# EAGLE design led_jetracer (EAGLE 9.6.2)
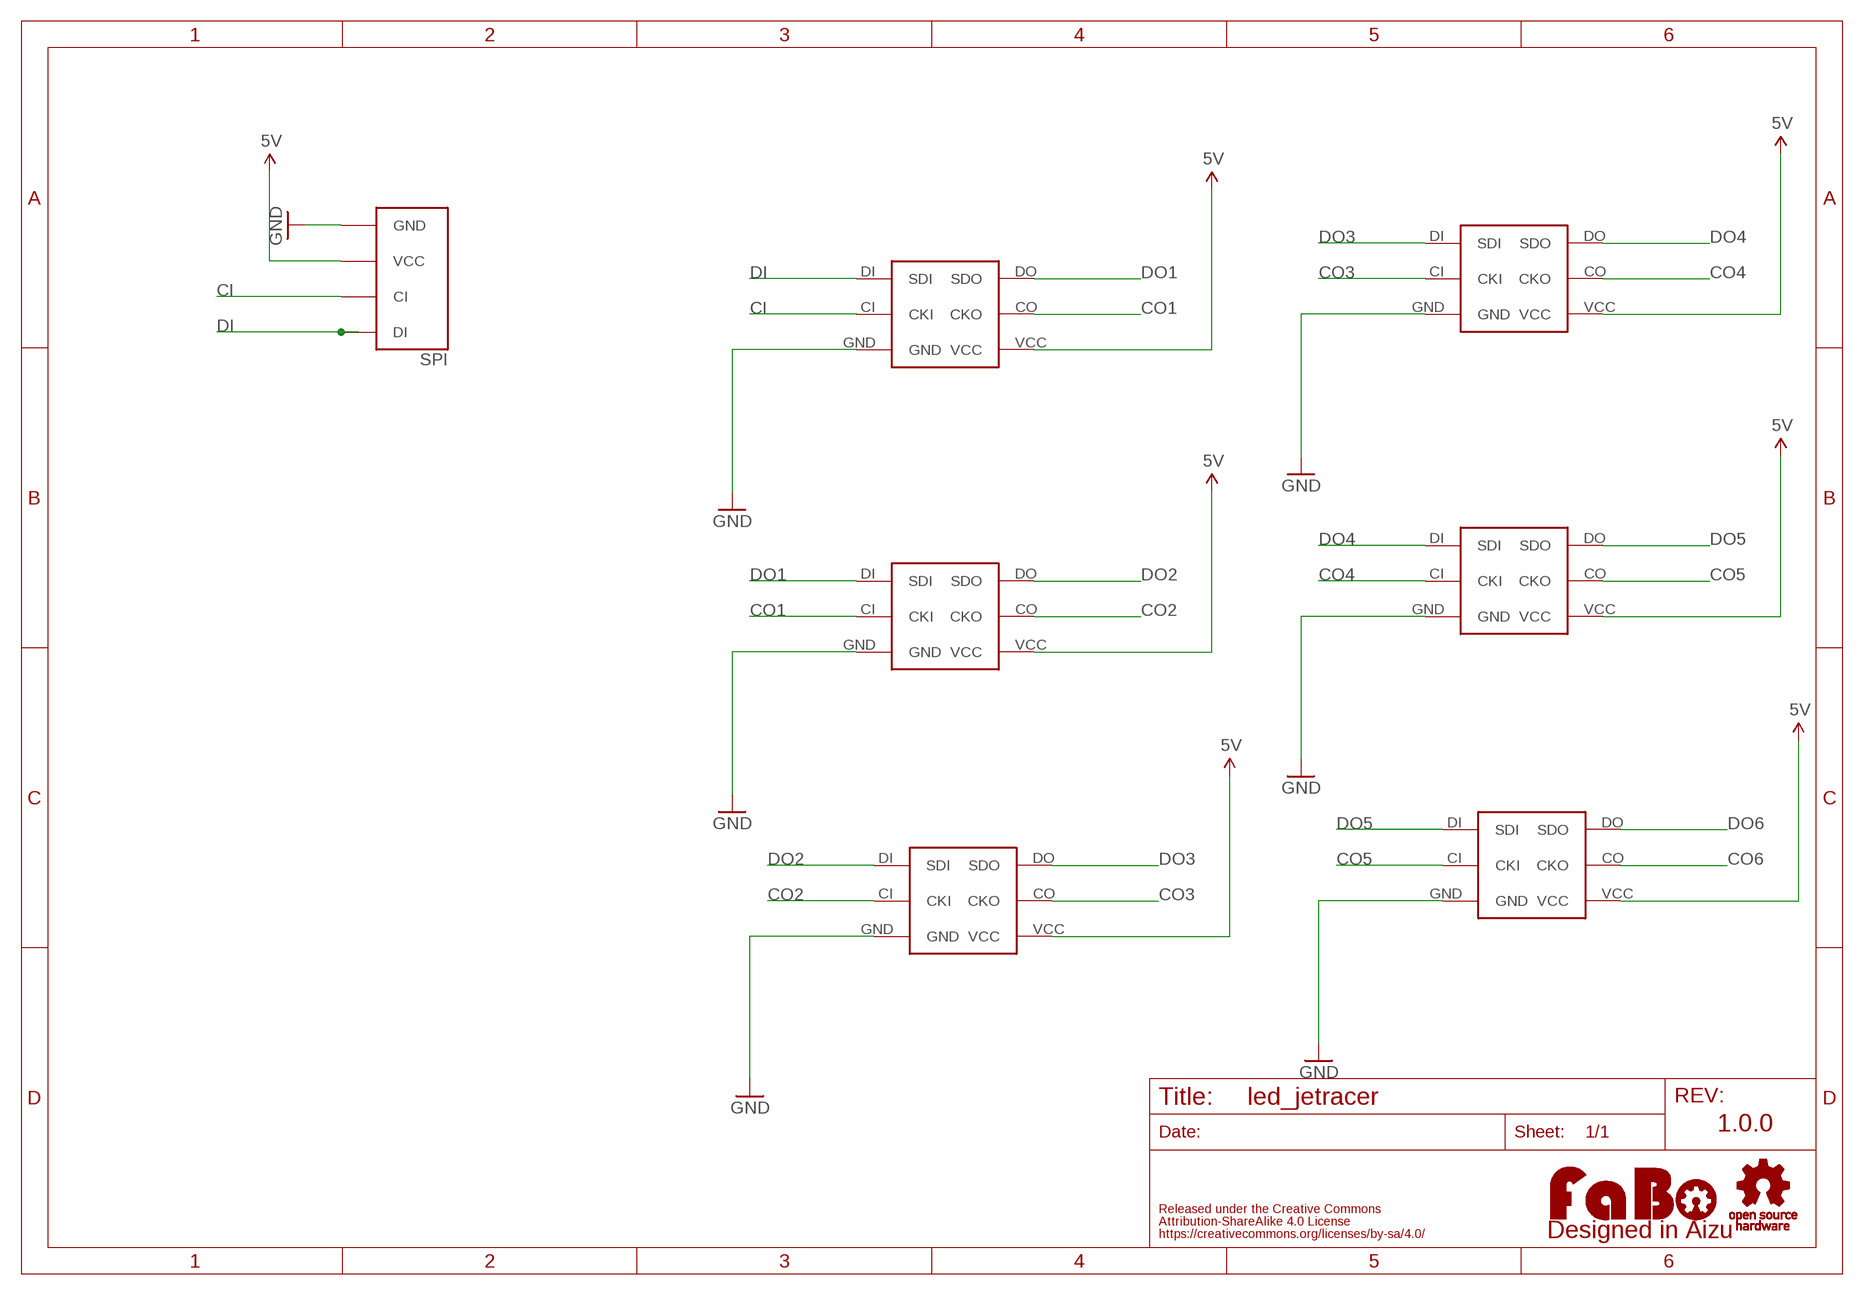
[diagram p0: schematic, sheet 1]

## Parts
LED0  APA102_IPIXEL  [APA102(IPIXEL)]
LED1  APA102_IPIXEL  [APA102(IPIXEL)]
LED2  APA102_IPIXEL  [APA102(IPIXEL)]
LED3  APA102_IPIXEL  [APA102(IPIXEL)]
LED4  APA102_IPIXEL  [APA102(IPIXEL)]
LED5  APA102_IPIXEL  [APA102(IPIXEL)]
LOGO1  LOGO_FABO-S  [LOGO_FABO_S]
SPI  FABO-SPI-LED-B04B-BOTTOM  [SPI-B04-PASK-1-BOTTOM]
U$2  LOGO_OSHW-S_BOTTOM  [LOGO_OSHW_S_BOTTOM]

## Nets
5V: LED0.VCC LED1.VCC LED2.VCC LED3.VCC LED4.VCC LED5.VCC SPI.VCC
CI: LED0.CI(CKI) SPI.CI
CO1: LED0.CO(CKO) LED1.CI(CKI)
CO2: LED1.CO(CKO) LED2.CI(CKI)
CO3: LED2.CO(CKO) LED3.CI(CKI)
CO4: LED3.CO(CKO) LED4.CI(CKI)
CO5: LED4.CO(CKO) LED5.CI(CKI)
CO6: LED5.CO(CKO)
DI: LED0.DI(SDI) SPI.DI
DO1: LED0.DO(SDO) LED1.DI(SDI)
DO2: LED1.DO(SDO) LED2.DI(SDI)
DO3: LED2.DO(SDO) LED3.DI(SDI)
DO4: LED3.DO(SDO) LED4.DI(SDI)
DO5: LED4.DO(SDO) LED5.DI(SDI)
DO6: LED5.DO(SDO)
GND: LED0.GND LED1.GND LED2.GND LED3.GND LED4.GND LED5.GND SPI.GND

## Notes on the sheet
- 1.0.0

## Library data of the parts
LED0 LED1-LED5 = FaBo-LED:APA102
LOGO1 = component:LOGO_FABO
SPI = FaBo-Connetor:FABO-SPI-LED
U$2 = component:LOGO_OSHW

## Board
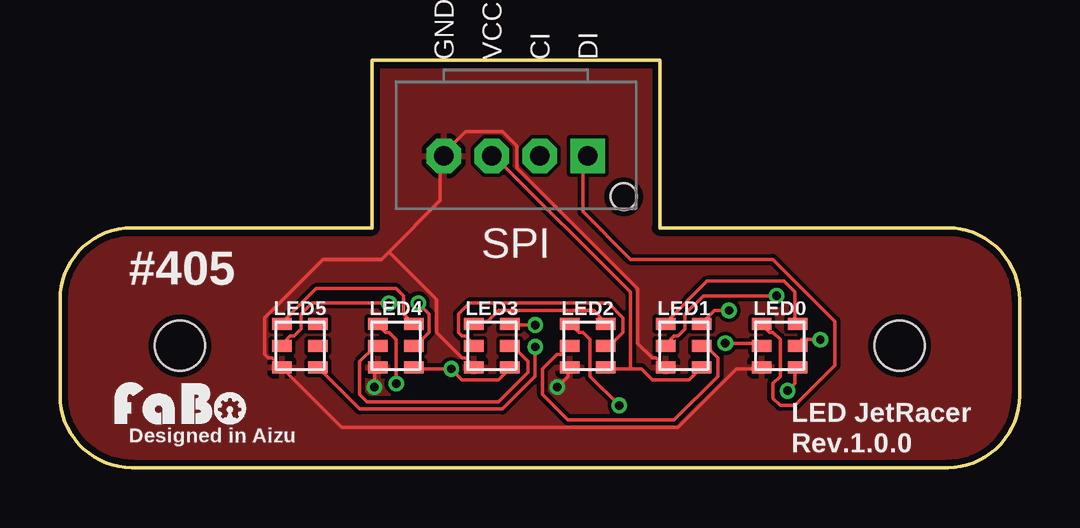
[diagram p1: board, top side]
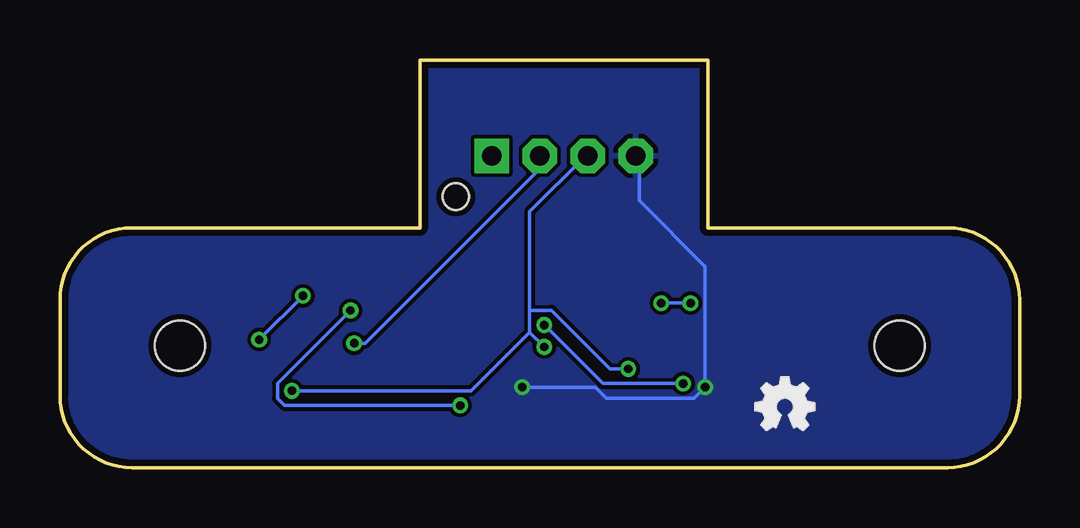
[diagram p2: board, bottom side, seen from below]

Size 40 x 17 mm. Coordinates in mm from the lower left corner, seen from the top.
Outline: 3,0 37,0 arc90 40,3 40,7 arc90 37,10 25,10 25,17 13,17 13,10 3,10 arc90 0,7 0,3 arc90 3,0
Copper layers (1*16): Top 0.035mm / dielectric 1.6mm / Bottom 0.035mm
Design rules "PCBway": minimum track width 6mil, minimum drill 12mil, track to track 6mil, track to pad 6mil, pad to pad 6mil, via to via 6mil, smd to smd 6mil, copper to edge 10mil, drill to drill 10mil, minimum pad ring 10mil, minimum via ring 6mil, stop-mask expansion 2mil, vias tented up to drill 100mil, thermal gap 8mil
Holes 2.1 mm at 5,5.08 35,5.08

### Footprints (pad centres in the part's own frame; a part is rotated, then mirrored left to right if it is on the bottom)
APA102(IPIXEL) = smd 0.8 x 0.5: CI -0.75,0; CO 0.75,0; DI -0.75,0.9; DO 0.75,0.9; GND -0.75,-0.9; VCC 0.75,-0.9
SPI-B04-PASK-1-BOTTOM = drill 0.8 pad 1.422 octagon: CI -1,0; GND 3,0; VCC 1,0 | drill 0.8 pad 1.422 square: DI -3,0 | hole 1.1: -4.5,1.7

### Placement (x,y rotation side)
LED0  30,5.08 0 top
LED1  26,5.08 0 top
LED2  22,5.08 0 top
LED3  18,5.08 0 top
LED4  14,5.08 0 top
LED5  10,5.08 0 top
LOGO1  5.08,1.65 0 top
SPI  19,13 180 top
U$2  9.78,2.54 0 top

### Tracks (layer width: path | path; a pad name or v marks a point on that pad's centre or on a via)
5V  (via drill 0.35)
  Top 0.152: 23.77,4.12 24.23,4.12 24.69,3.66 26.21,3.66 26.67,4.12 LED1.VCC | 23.77,4.12 22.86,4.12 LED2.VCC | LED4.VCC 14.78,4.12 v16.31,4.12 16.76,3.66 18.29,3.66 18.75,4.12 LED3.VCC | v19.81,5.03 19.81,3.81 18.44,2.44 12.5,2.44 10.82,4.12 LED5.VCC | v30.33,3.2 30.63,3.5 30.63,4.12 LED0.VCC | 23.77,4.12 23.77,7.32 18.14,12.95 SPI.VCC
  Bottom 0.152: 20.42,5.64 v19.81,5.03 | 20.42,6.55 20.42,10.67 18.14,12.95 SPI.VCC | 20.42,6.55 20.42,5.64 | v30.33,3.2 22.86,3.2 20.42,5.64 | v16.31,4.12 17.07,4.12 19.51,6.55 20.42,6.55
CI  (via drill 0.35)
  Top 0.152: v27.74,5.18 29.11,5.18 LED0.CI
  Bottom 0.152: v27.74,5.18 27.28,5.18 20.12,12.34 20.12,12.95 SPI.CI
CO1  (via drill 0.35)
  Top 0.152: v29.87,7.16 26.82,7.16 26.06,6.4 26.06,5.79 25.76,5.49 25.6,5.49 25.3,5.18 LED1.CI | v31.7,5.33 30.94,5.33 30.79,5.18 LED0.CO
  Bottom 0.152: v31.7,5.33 v29.87,7.16
CO2
  Top 0.152: LED2.CI 21.18,5.03 20.88,4.72 20.73,4.72 20.12,4.12 20.12,3.05 21.18,1.98 25.6,1.98 27.43,3.81 27.43,4.57 26.82,5.18 LED1.CO
CO3
  Top 0.152: LED3.CI 17.22,5.18 16.92,5.49 16.76,5.49 16.61,5.64 16.61,6.4 17.07,6.86 22.86,6.86 23.47,6.25 23.47,5.64 22.86,5.03 LED2.CO
CO4
  Top 0.152: LED4.CI 13.11,5.03 12.5,4.42 12.5,3.05 12.8,2.74 18.29,2.74 19.51,3.96 19.51,4.42 18.9,5.03 LED3.CO
CO5  (via drill 0.35)
  Top 0.152: v13.72,6.86 10.52,6.86 10.06,6.4 10.06,5.79 9.75,5.49 9.6,5.49 9.3,5.18 LED5.CI | v14.94,6.86 15.39,6.4 15.39,5.64 14.78,5.03 LED4.CO
  Bottom 0.152: v14.94,6.86 v13.72,6.86
DI
  Top 0.152: LED0.DI 29.26,5.94 29.57,5.64 29.72,5.64 30.02,5.33 30.02,3.81 29.72,3.5 29.72,2.9 30.02,2.59 30.63,2.59 32.31,4.27 32.31,6.1 29.72,8.69 23.77,8.69 21.79,10.67 21.79,12.8 21.95,12.95 SPI.DI
DO1
  Top 0.152: LED1.DI 25.3,6.1 26.98,7.77 30.18,7.77 30.63,7.32 30.63,6.1 LED0.DO
DO2  (via drill 0.35)
  Top 0.152: v23.32,2.59 22.1,3.81 22.1,5.33 21.79,5.64 21.64,5.64 21.34,5.94 LED2.DI | v27.89,6.55 27.28,6.55 26.82,6.1 LED1.DO
  Bottom 0.152: v23.32,2.59 30.63,2.59 30.94,2.9 30.94,3.5 v27.89,6.55
DO3
  Top 0.152: LED3.DI 17.37,6.1 17.83,6.1 18.29,6.55 22.25,6.55 22.71,6.1 LED2.DO
DO4  (via drill 0.35)
  Top 0.152: v14.02,3.5 14.02,5.33 13.72,5.64 13.56,5.64 13.26,5.94 LED4.DI | v19.81,5.94 18.9,5.94 LED3.DO
  Bottom 0.152: v14.02,3.5 17.37,3.5 v19.81,5.94
DO5
  Top 0.152: LED5.DI 9.3,6.1 10.67,7.47 14.02,7.47 14.33,7.16 14.33,6.4 14.63,6.1 LED4.DO
GND  (via drill 0.35)
  Top 0.152: 13.72,8.99 15.85,11.12 15.85,12.95 SPI.GND 16,13.11 16.92,14.02 18.44,14.02 19.05,13.41 19.05,12.5 24.08,7.47 24.08,5.18 24.69,4.57 24.84,4.57 25.15,4.27 LED1.GND | 13.72,8.99 13.41,8.69 10.97,8.69 8.53,6.25 8.53,4.72 8.69,4.57 8.84,4.57 9.14,4.27 LED5.GND 9.3,4.12 11.73,1.68 25.76,1.68 28.19,4.12 29.11,4.12 LED0.GND | v13.11,3.35 13.11,4.12 LED4.GND | 13.72,8.99 15.7,7.01 15.7,5.64 16.76,4.57 16.92,4.57 17.22,4.27 LED3.GND | v20.73,3.35 21.18,3.81 21.18,4.12 LED2.GND
  Bottom 0.152: SPI.GND 15.85,12.95 15.85,11.12 13.11,8.38 v13.11,3.35 13.56,2.9 17.22,2.9 17.68,3.35 v20.73,3.35
  pour Top: 0,0 40,0 40,17 0,17
  pour Bottom: 0,0 40,0 40,1 40,17 0,17

### Text on the board
tPlace: #405 | Designed in Aizu | LED JetRacer | Rev.1.0.0